# Altium project EDA-02189-V4-0_project.PrjPcb
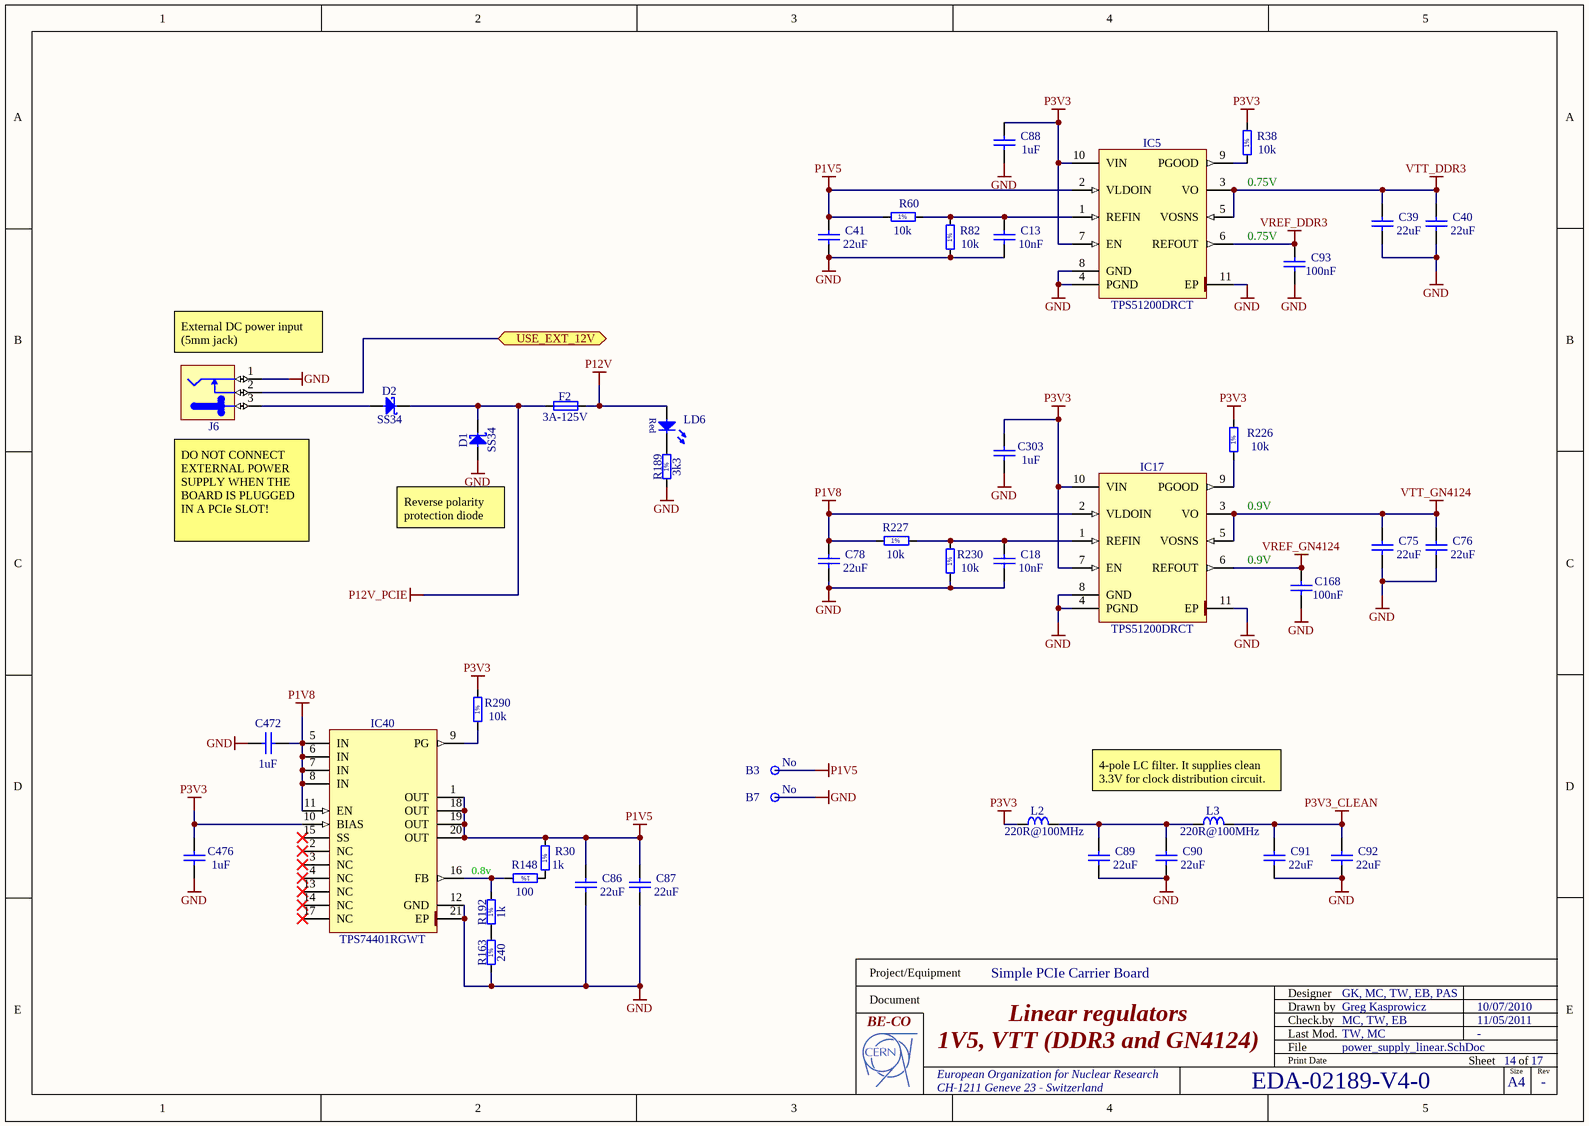
[diagram p0: power_supply_linear.SchDoc]
2 sheets, 119 parts. Net scope: flat (ports and power ports of the same name join across sheets).
Board file: EDA-02189-V4-0_pcb.PcbDoc
Sheets:
  power_supply_linear.SchDoc
  power_supply_switching.SchDoc

## Sheet power_supply_linear.SchDoc: Linear regulators
size 297 x 209 mm; CheckedBy: MC, TW, EB; CompanyName: CERN; DrawnBy: Greg Kasprowicz; Organization: CERN; Address1: European Organization for Nuclear Research; Address2: CH-1211 Geneve 23 - Switzerland; DocumentNumber: 14; Revision: -; SheetNumber: 14; SheetTotal: 17; EDA_Number: EDA-02189-V4-0; Projet: Simple PCIe Carrier Board; ModifiedBy: TW, MC; CreateDate: 10/07/2010; CheckedDate: 11/05/2011; Title2: 1V5, VTT (DDR3 and GN4124); DivGrp: BE-CO; Designer: GK, MC, TW, EB, PAS; ModifiedDate: -

### Parts
B3  Mounted: No  [VERO_20-2136]  (hidden comment: Test Point)
B7  Mounted: No  [VERO_20-2136]  (hidden comment: Test Point)
C13  10nF  [CAPC1608X87N]
C18  10nF  [CAPC1608X87N]
C39  22uF  [CAPC3216X180N]
C40  22uF  [CAPC3216X180N]
C41  22uF  [CAPC3216X180N]
C75  22uF  [CAPC3216X180N]
C76  22uF  [CAPC3216X180N]
C78  22uF  [CAPC3216X180N]
C86  22uF  [CAPC3216X180N]
C87  22uF  [CAPC3216X180N]
C88  1uF  [CAPC1608X87N]
C89  22uF  [CAPC3216X180N]
C90  22uF  [CAPC3216X180N]
C91  22uF  [CAPC3216X180N]
C92  22uF  [CAPC3216X180N]
C93  100nF  [CAPC1005X55N]
C168  100nF  [CAPC1608X87N]
C303  1uF  [CAPC1608X87N]
C472  1uF  [CAPC1608X87N]
C476  1uF  [CAPC1608X87N]
D1  SS34  [DIOM7659X265N]
D2  SS34  [DIOM7659X265N]
F2  3A-125V  [FUSE_LITTELFUSE_0154]
IC5  TPS51200DRCT  [SON50P300X300X100-11N-R175X250]
IC17  TPS51200DRCT  [SON50P300X300X100-11N-R175X250]
IC40  TPS74401RGWT  [QFN65P500X500X100-21N-S325]
J6  Jack  [LUMBERG_161314]  (value not drawn)
L2  220R@100MHz  [INDC2012X105N]
L3  220R@100MHz  [INDC2012X105N]
LD6  Red  [LEDC1608X80N_RED]  (value not drawn)
R30  1k  [RESC1608X55N]
R38  10k  [RESC1608X55N]
R60  10k  [RESC1608X55N]
R82  10k  [RESC1608X55N]
R148  100  [RESC1608X55N]
R163  240  [RESC1608X55N]
R189  3k3  [RESC1608X55N]
R192  1k  [RESC1608X55N]
R226  10k  [RESC1608X55N]
R227  10k  [RESC1608X55N]
R230  10k  [RESC1608X55N]
R290  10k  [RESC1608X55N]

### Ports
USE_EXT_12V (bidir)

### Nets
GND: B7.1 C13.1 C18.1 C39.1 C40.1 C41.1 C75.1 C76.1 C78.1 C86.1 C87.1 C88.1 C89.1 C90.1 C91.1 C92.1 C93.1 C168.1 C303.1 C472.1 C476.1 D1.2(A) IC5.4(PGND) IC5.8(GND) IC5.11(EP) IC17.4(PGND) IC17.8(GND) IC17.11(EP) IC40.12(GND) IC40.21(EP) J6.1 R82.1 R163.1 R189.1 R230.1
P1V5: B3.1 C41.2 C86.2 C87.2 IC5.2(VLDOIN) IC40.1(OUT) IC40.18(OUT) IC40.19(OUT) IC40.20(OUT) R30.2 R60.1
P1V8: C78.2 C472.2 IC17.2(VLDOIN) IC40.5(IN) IC40.6(IN) IC40.7(IN) IC40.8(IN) IC40.11(EN) R227.1
P3V3: C88.2 C303.2 C476.2 IC5.7(EN) IC5.10(VIN) IC17.7(EN) IC17.10(VIN) IC40.10(BIAS) L2.1 R38.2 R226.2 R290.2
P3V3_CLEAN: C91.2 C92.2 L3.2
P12V: F2.2 LD6.2(A)
P12V_PCIE: D1.1(C) D2.1(C) F2.1
VREF_DDR3: C93.2 IC5.6(REFOUT)
VREF_GN4124: C168.2 IC17.6(REFOUT)
VTT_DDR3: C39.2 C40.2 IC5.3(VO) IC5.5(VOSNS)
VTT_GN4124: C75.2 C76.2 IC17.3(VO) IC17.5(VOSNS)
NetC13_2: C13.2 IC5.1(REFIN) R60.2 R82.2
NetC18_2: C18.2 IC17.1(REFIN) R227.2 R230.2
NetC89_2: C89.2 C90.2 L2.2 L3.1
NetD2_2: D2.2(A) J6.3
NetIC5_9: IC5.9(PGOOD) R38.1
NetIC17_9: IC17.9(PGOOD) R226.1
NetIC40_9: IC40.9(PG) R290.1
NetIC40_16: IC40.16(FB) R148.2 R192.2
NetJ6_2: J6.2 ; port USE_EXT_12V
NetLD6_1: LD6.1(C) R189.2
NetR30_1: R30.1 R148.1
NetR163_2: R163.2 R192.1

Not connected (* = marked no-connect by the designer): IC40 2(NC)* 3(NC)* 4(NC)* 13(NC)* 14(NC)* 15(SS)* 17(NC)*

### Notes on the sheet
- (near R38) 0.75V
- (near C93) 0.75V
- (near J6) External DC power input (5mm jack)
- (near J6) DO NOT CONNECT EXTERNAL POWER SUPPLY WHEN THE BOARD IS PLUGGED IN A PCIe SLOT!
- (near D1) Reverse polarity protection diode
- 0.9V
- (near L3) 4-pole LC filter. It supplies clean 3.3V for clock distribution circuit.
- 0.8v
- Project/Equipment
- Document
- Designer
- Drawn by
- Check.by
- File
- Last Mod.
- Print Date
- Sheet
- Size
- A4
- of
- Rev
- (in symbol R0603_1K_1%_0.1W_100PPM) 1%
- (in symbol R0603_3K3_1%_0.1W_100PPM) 1%
- (in symbol R0603_10K_1%_0.1W_100PPM) 1%
- (in symbol R0603_100R_1%_0.1W_100PPM) 1%
- (in symbol R0603_240R_1%_0.1W_100PPM) 1%

### Library data of the parts
B3 B7 = VERO_20-2136: Single Terminal Socket; Part Description: Black Bead PCB Terminal Test Pin (1.32 mm hole); Manufacturer: VERO TECHNOLOGIES; Table: Miscellaneous; Part Number: VERO_20-2136; Component Kind: Standard; Component Type: Standard; Pin Count: 1; Family: Test Point; Socket: No; SMD: No; Status: None; Manufacturer Part Number: 20-2136; ComponentHeight: 5.3mm; HelpURL: \\cern.ch\dfs\Applications\Altium\Datasheets\VERO_20-2136.pdf; Author: CERN DEM JLC; CreateDate: 21/07/2008; LatestRevisionDate: 21/07/2008
C13 C18 = CC0603_10NF_50V_10%_X7R: Non-polarised capacitor; Part Description: SMD Multilayer Chip Ceramic Capacitor; Manufacturer: GENERIC; Manufacturer1 Part Number: 223858615636; Voltage: 50V; TC: X7R; Tolerance: ±10%; Table: Capacitors SMD; Part Number: CC0603_10NF_50V_10%_X7R; Component Kind: Standard; Component Type: Standard; Pin Count: 2; Value: 10nF; Status: Preferred; Manufacturer Part Number: CC0603_10NF_50V_10%_X7R; Case: 0603; Mounted: Yes; Socket: No; SMD: Yes; Manufacturer1 Example: PHYCOMP; Manufacturer1 ComponentHeight: 0.87mm; HelpURL: \\cern.ch\dfs\Applications\Altium\Datasheets\CC0603_X7R_PHYCOMP.pdf; Author: CERN DEM JLC; CreateDate: 03/12/2007; LatestRevisionDate: 03/12/2007
C39-C41 C75 C76 C78 C86 C87 C89-C92 = CC1206_22UF_10V_10%_X7R: Non-polarised capacitor; Part Description: SMD Multilayer Chip Ceramic Capacitor; Manufacturer: GENERIC; Manufacturer1 Part Number: GRM31CR71A226KE15L; Voltage: 10V; TC: X7R; Tolerance: ±10%; Table: Capacitors SMD; Part Number: CC1206_22UF_10V_10%_X7R; Component Kind: Standard; Component Type: Standard; Pin Count: 2; Value: 22uF; Status: Preferred; Manufacturer Part Number: CC1206_22UF_10V_10%_X7R; Case: 1206; Mounted: Yes; Socket: No; SMD: Yes; Manufacturer1 Example: MURATA; Manufacturer1 ComponentHeight: 1.8mm; HelpURL: \\cern.ch\dfs\Applications\Altium\Datasheets\CC1206_X7R_MURATA_GRM-HI-CAP.pdf; Author: CERN DEM JLC; CreateDate: 2010-06-08; LatestRevisionDate: 2010-06-08
C88 C303 C472 C476 = CC0603_1UF_16V_10%_X7R: Non-polarised capacitor; Part Description: SMD Multilayer Chip Ceramic Capacitor; Manufacturer: GENERIC; Manufacturer1 Part Number: 223824613663; Voltage: 16V; TC: X7R; Tolerance: ±10%; Table: Capacitors SMD; Part Number: CC0603_1UF_16V_10%_X7R; Component Kind: Standard; Component Type: Standard; Pin Count: 2; Value: 1uF; Status: Preferred; Manufacturer Part Number: CC0603_1uF_16V_10%_X7R; Case: 0603; Mounted: Yes; Socket: No; SMD: Yes; Manufacturer1 Example: PHYCOMP; Manufacturer1 ComponentHeight: 0.87mm; HelpURL: \\cern.ch\dfs\Applications\Altium\Datasheets\CC0805_X5R_PHYCOMP_HC.pdf; Author: CERN DEM JLC
  C88 C303: CreateDate: 03/12/2007; LatestRevisionDate: 03/12/2007
  C472 C476: CreateDate: 12/3/2007; LatestRevisionDate: 12/3/2007
C93 = CC0402_100NF_16V_10%_X7R: Non-polarised capacitor; Part Description: SMD Multilayer Chip Ceramic Capacitor; Manufacturer: GENERIC; Manufacturer1 Part Number: 223878715649; Manufacturer1 Datasheet: \\cern.ch\dfs\Applications\Altium\Datasheets\CC0402_X7R_PHYCOMP.pdf; Voltage: 16V; TC: X7R; Tolerance: ±10%; Table: Capacitors SMD; Part Number: CC0402_100NF_16V_10%_X7R; Component Kind: Standard; Component Type: Standard; Designator: Capacitor - non polarized; Library Reference: Capacitor - non polarized; Pin Count: 2; Value: 100nF; Status: Not Recommended; Manufacturer Part Number: CC0402_100NF_16V_10%_X7R; Case: 0402; Mounted: Yes; Socket: No; SMD: Yes; Manufacturer1 Example: PHYCOMP; Manufacturer1 ComponentHeight: 0.55mm; HelpURL: \\cern.ch\dfs\Applications\Altium\Datasheets\CC0402_X7R_PHYCOMP.pdf; Author: CERN DEM JLC; CreateDate: 12/3/2007; LatestRevisionDate: 12/3/2007
C168 = CC0603_100NF_50V_10%_X7R: Non-polarised capacitor; Part Description: SMD Multilayer Chip Ceramic Capacitor; Manufacturer: GENERIC; Manufacturer1 Part Number: 223858615649; Voltage: 50V; TC: X7R; Tolerance: ±10%; Table: Capacitors SMD; Part Number: CC0603_100NF_50V_10%_X7R; Component Kind: Standard; Component Type: Standard; Pin Count: 2; Value: 100nF; Status: Preferred; Manufacturer Part Number: CC0603_100NF_50V_10%_X7R; Case: 0603; Mounted: Yes; Socket: No; SMD: Yes; Manufacturer1 Example: PHYCOMP; Manufacturer1 ComponentHeight: 0.87mm; HelpURL: \\cern.ch\dfs\Applications\Altium\Datasheets\CC0603_X7R_PHYCOMP.pdf; Author: CERN DEM JLC; CreateDate: 03/12/2007; LatestRevisionDate: 03/12/2007
D1 D2 = SS34: Schottky Diode; Part Description: Surface Mount Schottky Barrier Rectifier; Manufacturer: FAIRCHILD SEMICONDUCTOR; Voltage: 40V; Power: 3A; Table: Diodes; Part Number: SS34; Component Kind: Standard; Component Type: Standard; Device: SS34; PackageDescription: DO-214-AB/SMC Molded Diode, Body 7.95x5.9mm, IPC Medium Density; Manufacturer Part Number: SS34; Pin Count: 2; Case: DO-214AC; Mounted: Yes; Socket: No; SMD: Yes; ComponentHeight: 2.65mm; HelpURL: \\cern.ch\dfs\Applications\Altium\Datasheets\SS34.pdf; Author: CERN DEM JLC; CreateDate: 8/23/2010; LatestRevisionDate: 8/23/2010
F2 = FUSE_LITTELFUSE_0154003.DR: Fuse; Part Description: SMF OMNI-BLOK® Very Fast-Acting Fuse and Holder; Table: Fuses; Part Number: FUSE_LITTELFUSE_0154003.DR; Component Kind: Standard; Component Type: Standard; Pin Count: 2; PackageDescription: SMF Fuse and Holder, 2-Leads, Body 9.73x5.03mm; Family: Fuse & Holder; Mounted: Yes; Socket: No; SMD: Yes; Value: 3A-125V; Manufacturer: LITTELFUSE; Manufacturer Part Number: 0154003.DR; ComponentHeight: 3.81mm; HelpURL: \\cern.ch\dfs\Applications\Altium\Datasheets\FUSE_LITTELFUSE_0154.pdf; Author: CERN DEM JMW; CreateDate: 1/8/2009; LatestRevisionDate: 1/8/2009
IC5 IC17 = TPS51200DRCT: Sink/Source DDR Termination Regulator; Part Description: 3.3V Sink/Source DDR Termination Regulator; Manufacturer: TEXAS INSTRUMENTS; Table: Regulators; Part Number: TPS51200DRCT; Component Kind: Standard; Component Type: Standard; Device: TPS51200DRCT; PackageDescription: SON, 0.50mm Pitch, 10-pin, 3.00mm W  X 3.00mm L X 1.00mm Height, (w/thermal tab 1.75 X 2.50 mm), IPC Medium Density; Manufacturer Part Number: TPS51200DRCT; Pin Count: 10; Case: SON10; Mounted: Yes; Socket: No; SMD: Yes; ComponentHeight: 1mm; HelpURL: \\cern.ch\dfs\Applications\Altium\Datasheets\TPS51200DRCT.pdf; Author: CERN DEM JLC; CreateDate: 2/3/2010; LatestRevisionDate: 2/3/2010
IC40 = TPS74401RGWT: Single Output LDO, 3.0A, Adj.(0.8 to 3.3V), Fast Transient Response, Programmable SoftStart; Manufacturer: TEXAS INSTRUMENTS; Table: Regulators; Part Number: TPS74401RGWT; Component Kind: Standard; Component Type: Standard; Device: TPS74401RGWT; PackageDescription: QFN, 0.65mm pitch,square; 20 pin, 5mm X 5mm X 1mm H body (w/thermal tab 3.25 X 3.25mm),  IPC Medium Density; Part Description: Single Output LDO, 3.0A, Adj.(0.8 to 3.3V), Fast Transient Response, Programmable SoftStart; Manufacturer Part Number: TPS74401RGWT; Pin Count: 21; Case: QFN20; Mounted: Yes; Socket: No; SMD: Yes; ComponentHeight: 1mm; HelpURL: \\cern.ch\dfs\Applications\Altium\Datasheets\TPS74401RGWT.pdf; Author: CERN DEM JLC; CreateDate: 2/2/2010; LatestRevisionDate: 2/2/2010
J6 = LUMBERG_161314: 24V /3. 5A, 2.1mm Diameter Pin, SMD DC Power Supply Connector With  Break Contact; Manufacturer Part Number: 161314; Table: Miscellaneous; Part Number: LUMBERG_161314; Component Kind: Standard; Component Type: Standard; Pin Count: 3; Family: Jack; Mounted: Yes; Socket: No; SMD: Yes; Status: None; Part Description: 24V/3. 5A, 2.1mm Diameter Pin, SMD DC Power Supply Connector With  Break Contact; Manufacturer: LUMBERG; ComponentHeight: 11mm; HelpURL: \\cern.ch\dfs\Applications\Altium\Datasheets\LUMBERG_161314.pdf; Author: CERN DEM JLC; CreateDate: 2/15/2011; LatestRevisionDate: 3/2/2011
L2 L3 = IND0805_MURATA_BLM21PG221SN1D: Inductor; Part Description: SMD EMIFIL Suppression Chip Bead Ferrite; Manufacturer: MURATA; Power: 2A; Resistance: 0.05R; Tolerance: ±25%; Table: Inductors SMD; Part Number: IND0805_MURATA_BLM21PG221SN1D; Component Kind: Standard; Component Type: Standard; Pin Count: 2; Value: 220R@100MHz; Status: None; Manufacturer Part Number: BLM21PG221SN1D; Case: 0805; Mounted: Yes; Socket: No; SMD: Yes; ComponentHeight: 1.05mm; HelpURL: \\cern.ch\dfs\Applications\Altium\Datasheets\IND0402_MURATA_BLM21P.pdf; Author: CERN DEM JLC; CreateDate: 25/01/2010; LatestRevisionDate: 25/01/2010
LD6 = LED_ROHM_SML-311UTT86K: LED Red 1C 2A; Part Description: Low current chip LED SML-311 Serie; Manufacturer: ROHM; Table: LEDs & Displays; Part Number: LED_ROHM_SML-311UTT86K; Component Kind: Standard; Component Type: Standard; Color: Red; PackageDescription: Chip Red LED, 2-Leads, Body 1.6x0.8mm, IPC Medium Density; Manufacturer Part Number: SML-311UTT86K; Pin Count: 2; Mounted: Yes; Socket: No; SMD: Yes; ComponentHeight: 0.8mm; HelpURL: \\cern.ch\dfs\Applications\Altium\Datasheets\LED_ROHM_SML-311UTT86K.pdf; Author: CERN DEM JLC; CreateDate: 3/16/2010; LatestRevisionDate: 3/17/2010
R30 R192 = R0603_1K_1%_0.1W_100PPM: Resistor - 1%; Part Description: General Purpose Thick Film Chip Resistor; Manufacturer: GENERIC; Manufacturer1 Part Number: NRC06F1001TRF; Power: 0.1W; TC: ±100ppm/°C; Table: Resistors SMD; Part Number: R0603_1K_1%_0.1W_100PPM; Component Kind: Standard; Component Type: Standard; Pin Count: 2; Value: 1k; Status: Preferred; Tolerance: ±1%; Manufacturer Part Number: R0603_1K_1%_0.1W_100PPM; Case: 0603; Mounted: Yes; Socket: No; SMD: Yes; Manufacturer1 Example: NIC COMPONENT; Manufacturer1 ComponentHeight: 0.55mm; HelpURL: \\cern.ch\dfs\Applications\Altium\Datasheets\R0603_NIC_NRC.pdf; Author: CERN DEM JLC; CreateDate: 12/3/2007; LatestRevisionDate: 3/13/2008
R38 R60 R82 R226 R227 R230 R290 = R0603_10K_1%_0.1W_100PPM: Resistor - 1%; Part Description: General Purpose Thick Film Chip Resistor; Manufacturer: GENERIC; Manufacturer1 Part Number: NRC06F1002TRF; Power: 0.1W; TC: ±100ppm/°C; Table: Resistors SMD; Part Number: R0603_10K_1%_0.1W_100PPM; Component Kind: Standard; Component Type: Standard; Pin Count: 2; Value: 10k; Status: Preferred; Tolerance: ±1%; Manufacturer Part Number: R0603_10K_1%_0.1W_100PPM; Case: 0603; Mounted: Yes; Socket: No; SMD: Yes; Manufacturer1 Example: NIC COMPONENT; Manufacturer1 ComponentHeight: 0.55mm; HelpURL: \\cern.ch\dfs\Applications\Altium\Datasheets\R0603_NIC_NRC.pdf; Author: CERN DEM JLC
  R38 R60 R82 R227 R230 R290: CreateDate: 12/3/2007; LatestRevisionDate: 3/13/2008
  R226: CreateDate: 03/12/2007; LatestRevisionDate: 13/03/2008
R148 = R0603_100R_1%_0.1W_100PPM: Resistor - 1%; Part Description: General Purpose Thick Film Chip Resistor; Manufacturer: GENERIC; Manufacturer1 Part Number: NRC06F4700TRF; Power: 0.1W; TC: ±100ppm/°C; Table: Resistors SMD; Part Number: R0603_100R_1%_0.1W_100PPM; Component Kind: Standard; Component Type: Standard; Pin Count: 2; Value: 100; Status: Preferred; Tolerance: ±1%; Manufacturer Part Number: R0603_100R_1%_0.1W_100PPM; Case: 0603; Mounted: Yes; Socket: No; SMD: Yes; Manufacturer1 Example: NIC COMPONENT; Manufacturer1 ComponentHeight: 0.55mm; HelpURL: \\cern.ch\dfs\Applications\Altium\Datasheets\R0603_NIC_NRC.pdf; Author: CERN DEM JLC; CreateDate: 2007-12-03; LatestRevisionDate: 2008-03-13
R163 = R0603_240R_1%_0.1W_100PPM: Resistor - 1%; Part Description: General Purpose Thick Film Chip Resistor; Manufacturer: GENERIC; Manufacturer1 Part Number: NRC06F2400TRF; Power: 0.1W; TC: ±100ppm/°C; Table: Resistors SMD; Part Number: R0603_240R_1%_0.1W_100PPM; Component Kind: Standard; Component Type: Standard; Pin Count: 2; Value: 240; Status: Preferred; Tolerance: ±1%; Manufacturer Part Number: R0603_240R_1%_0.1W_100PPM; Case: 0603; Mounted: Yes; Socket: No; SMD: Yes; Manufacturer1 Example: NIC COMPONENT; Manufacturer1 ComponentHeight: 0.55mm; HelpURL: \\cern.ch\dfs\Applications\Altium\Datasheets\R0603_NIC_NRC.pdf; Author: CERN DEM JLC; CreateDate: 12/3/2007; LatestRevisionDate: 3/13/2008
R189 = R0603_3K3_1%_0.1W_100PPM: Resistor - 1%; Part Description: General Purpose Thick Film Chip Resistor; Manufacturer: GENERIC; Manufacturer1 Part Number: NRC06F3301TRF; Power: 0.1W; TC: ±100ppm/°C; Table: Resistors SMD; Part Number: R0603_3K3_1%_0.1W_100PPM; Component Kind: Standard; Component Type: Standard; Pin Count: 2; Value: 3k3; Status: Preferred; Tolerance: ±1%; Manufacturer Part Number: R0603_3K3_1%_0.1W_100PPM; Case: 0603; Mounted: Yes; Socket: No; SMD: Yes; Manufacturer1 Example: NIC COMPONENT; Manufacturer1 ComponentHeight: 0.55mm; HelpURL: \\cern.ch\dfs\Applications\Altium\Datasheets\R0603_NIC_NRC.pdf; Author: CERN DEM JLC; CreateDate: 12/3/2007; LatestRevisionDate: 3/13/2008

## Sheet power_supply_switching.SchDoc: Switching regulators
size 297 x 209 mm; CheckedBy: MC, TW, EB; CompanyName: CERN; DrawnBy: Greg Kasprowicz; Organization: CERN; Address1: European Organization for Nuclear Research; Address2: CH-1211 Geneve 23 - Switzerland; DocumentNumber: 15; Revision: -; SheetNumber: 15; SheetTotal: 17; EDA_Number: EDA-02189-V4-0; Projet: Simple PCIe Carrier Board; ModifiedBy: TW, MC; CreateDate: 10/07/2010; CheckedDate: 11/05/2011; Title2: 3.3V, 2.5V, 1.8V and 1.2V; DivGrp: BE-CO; Designer: GK, MC, TW, EB, PAS; ModifiedDate: -
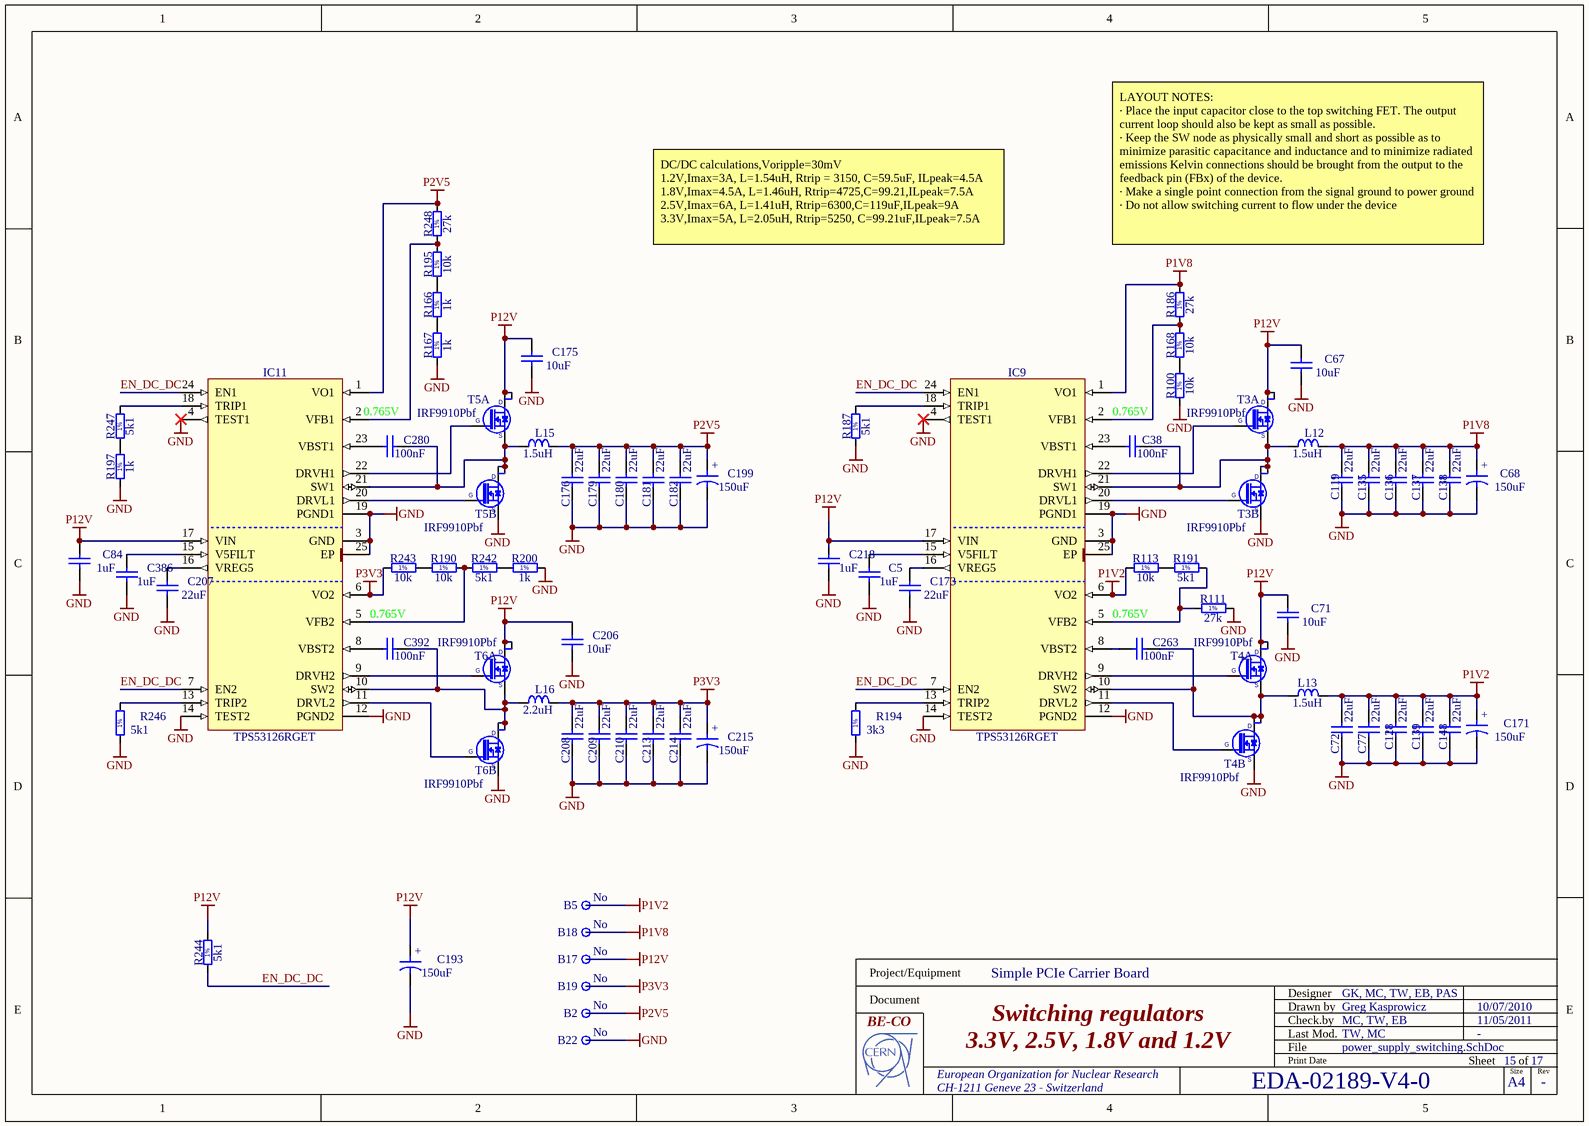
[diagram p1: power_supply_switching.SchDoc]

### Parts
B2  Mounted: No  [VERO_20-2136]  (hidden comment: Test Point)
B5  Mounted: No  [VERO_20-2136]  (hidden comment: Test Point)
B17  Mounted: No  [VERO_20-2136]  (hidden comment: Test Point)
B18  Mounted: No  [VERO_20-2136]  (hidden comment: Test Point)
B19  Mounted: No  [VERO_20-2136]  (hidden comment: Test Point)
B22  Mounted: No  [VERO_20-2136]  (hidden comment: Test Point)
C5  1uF  [CAPC1608X87N]
C38  100nF  [CAPC1608X87N]
C67  10uF  [CAPC3225X270N]
C68  150uF  [CAPPR350-850X700]
C71  10uF  [CAPC3225X270N]
C72  22uF  [CAPC3216X180N]
C77  22uF  [CAPC3216X180N]
C84  1uF  [CAPC1608X87N]
C119  22uF  [CAPC3216X180N]
C128  22uF  [CAPC3216X180N]
C135  22uF  [CAPC3216X180N]
C136  22uF  [CAPC3216X180N]
C137  22uF  [CAPC3216X180N]
C138  22uF  [CAPC3216X180N]
C139  22uF  [CAPC3216X180N]
C148  22uF  [CAPC3216X180N]
C171  150uF  [CAPPR350-850X700]
C173  22uF  [CAPC3216X180N]
C175  10uF  [CAPC3225X270N]
C176  22uF  [CAPC3216X180N]
C179  22uF  [CAPC3216X180N]
C180  22uF  [CAPC3216X180N]
C181  22uF  [CAPC3216X180N]
C182  22uF  [CAPC3216X180N]
C193  150uF  [CAPPR500-1050X800]
C199  150uF  [CAPPR350-850X700]
C206  10uF  [CAPC3225X270N]
C207  22uF  [CAPC3216X180N]
C208  22uF  [CAPC3216X180N]
C209  22uF  [CAPC3216X180N]
C210  22uF  [CAPC3216X180N]
C213  22uF  [CAPC3216X180N]
C214  22uF  [CAPC3216X180N]
C215  150uF  [CAPPR350-850X700]
C218  1uF  [CAPC1608X87N]
C263  100nF  [CAPC1608X87N]
C280  100nF  [CAPC1608X87N]
C386  1uF  [CAPC1608X87N]
C392  100nF  [CAPC1608X87N]
IC9  TPS53126RGET  [QFN50P400X400X100-25N-S255]
IC11  TPS53126RGET  [QFN50P400X400X100-25N-S255]
L12  1.5uH  [IND_BOURNS_SRR1260]
L13  1.5uH  [IND_BOURNS_SRR1260]
L15  1.5uH  [IND_BOURNS_SRR1260]
L16  2.2uH  [IND_BOURNS_SRR1260]
R100  10k  [RESC1608X55N]
R111  27k  [RESC1608X55N]
R113  10k  [RESC1608X55N]
R166  1k  [RESC1608X55N]
R167  1k  [RESC1608X55N]
R168  10k  [RESC1608X55N]
R186  27k  [RESC1608X55N]
R187  5k1  [RESC1608X55N]
R190  10k  [RESC1608X55N]
R191  5k1  [RESC1608X55N]
R194  3k3  [RESC1608X55N]
R195  10k  [RESC1608X55N]
R197  1k  [RESC1608X55N]
R200  1k  [RESC1608X55N]
R242  5k1  [RESC1608X55N]
R243  10k  [RESC1608X55N]
R244  5k1  [RESC1608X55N]
R246  5k1  [RESC1608X55N]
R247  5k1  [RESC1608X55N]
R248  27k  [RESC1608X55N]
T3  IRF9910Pbf  [SOIC127P600X175-8N]  (parts A,B of 2)
T4  IRF9910Pbf  [SOIC127P600X175-8N]  (parts A,B of 2)
T5  IRF9910Pbf  [SOIC127P600X175-8N]  (parts A,B of 2)
T6  IRF9910Pbf  [SOIC127P600X175-8N]  (parts A,B of 2)

### Nets
GND: B22.1 C5.1 C67.2 C68.2 C71.2 C72.1 C77.1 C84.2 C119.1 C128.1 C135.1 C136.1 C137.1 C138.1 C139.1 C148.1 C171.2 C173.1 C175.2 C176.1 C179.1 C180.1 C181.1 C182.1 C193.2 C199.2 C206.2 C207.1 C208.1 C209.1 C210.1 C213.1 C214.1 C215.2 C218.1 C386.1 IC9.3(GND) IC9.4(TEST1) IC9.12(PGND2) IC9.14(TEST2) IC9.19(PGND1) IC9.25(EP) IC11.3(GND) IC11.4(TEST1) IC11.12(PGND2) IC11.14(TEST2) IC11.19(PGND1) IC11.25(EP) R100.1 R111.2 R167.1 R187.1 R194.1 R197.1 R200.2 R246.1 T3.1(S) T4.1(S) T5.1(S) T6.1(S)
P1V2: B5.1 C72.2 C77.2 C128.2 C139.2 C148.2 C171.1 IC9.6(VO2) L13.2 R113.1
P1V8: B18.1 C68.1 C119.2 C135.2 C136.2 C137.2 C138.2 IC9.1(VO1) L12.2 R186.2
P2V5: B2.1 C176.2 C179.2 C180.2 C181.2 C182.2 C199.1 IC11.1(VO1) L15.2 R248.2
P3V3: B19.1 C208.2 C209.2 C210.2 C213.2 C214.2 C215.1 IC11.6(VO2) L16.2 R243.1
P12V: B17.1 C67.1 C71.1 C84.1 C175.1 C193.1 C206.1 C218.2 IC9.17(VIN) IC11.17(VIN) R244.2 T3.5(D) T3.6(D) T4.5(D) T4.6(D) T5.5(D) T5.6(D) T6.5(D) T6.6(D)
EN_DC_DC: IC9.7(EN2) IC9.24(EN1) IC11.7(EN2) IC11.24(EN1) R244.1
NetC5_2: C5.2 IC9.15(V5FILT)
NetC38_1: C38.1 IC9.21(SW1) L12.1 T3.3(S) T3.7(D) T3.8(D)
NetC38_2: C38.2 IC9.23(VBST1)
NetC173_2: C173.2 IC9.16(VREG5)
NetC207_2: C207.2 IC11.16(VREG5)
NetC263_1: C263.1 IC9.10(SW2) L13.1 T4.3(S) T4.7(D) T4.8(D)
NetC263_2: C263.2 IC9.8(VBST2)
NetC280_1: C280.1 IC11.21(SW1) L15.1 T5.3(S) T5.7(D) T5.8(D)
NetC280_2: C280.2 IC11.23(VBST1)
NetC386_2: C386.2 IC11.15(V5FILT)
NetC392_1: C392.1 IC11.10(SW2) L16.1 T6.3(S) T6.7(D) T6.8(D)
NetC392_2: C392.2 IC11.8(VBST2)
NetIC9_2: IC9.2(VFB1) R168.2 R186.1
NetIC9_5: IC9.5(VFB2) R111.1 R191.2
NetIC9_9: IC9.9(DRVH2) T4.4(G)
NetIC9_11: IC9.11(DRVL2) T4.2(G)
NetIC9_13: IC9.13(TRIP2) R194.2
NetIC9_18: IC9.18(TRIP1) R187.2
NetIC9_20: IC9.20(DRVL1) T3.2(G)
NetIC9_22: IC9.22(DRVH1) T3.4(G)
NetIC11_2: IC11.2(VFB1) R195.2 R248.1
NetIC11_5: IC11.5(VFB2) R190.2 R242.1
NetIC11_9: IC11.9(DRVH2) T6.4(G)
NetIC11_11: IC11.11(DRVL2) T6.2(G)
NetIC11_13: IC11.13(TRIP2) R246.2
NetIC11_18: IC11.18(TRIP1) R247.2
NetIC11_20: IC11.20(DRVL1) T5.2(G)
NetIC11_22: IC11.22(DRVH1) T5.4(G)
NetR100_2: R100.2 R168.1
NetR113_2: R113.2 R191.1
NetR166_1: R166.1 R167.2
NetR166_2: R166.2 R195.1
NetR190_1: R190.1 R243.2
NetR197_2: R197.2 R247.1
NetR200_1: R200.1 R242.2

### Notes on the sheet
- DC/DC calculations,Voripple=30mV
  1.2V,Imax=3A, L=1.54uH, Rtrip = 3150, C=59.5uF, ILpeak=4.5A
  1.8V,Imax=4.5A, L=1.46uH, Rtrip=4725,C=99.21,ILpeak=7.5A
  2.5V,Imax=6A, L=1.41uH, Rtrip=6300,C=119uF,ILpeak=9A
  3.3V,Imax=5A, L=2.05uH, Rtrip=5250, C=99.21uF,ILpeak=7.5A
- (near R186) LAYOUT NOTES:
  · Place the input capacitor close to the top switching FET. The output current loop should also be kept as small as possible.
  · Keep the SW node as physically small and short as possible as to minimize parasitic capacitance and inductance and to minimize radiated emissions Kelvin connections should be brought from the output to the feedback pin (FBx) of the device.
  · Make a single point connection from the signal ground to power ground
  · Do not allow switching current to flow under the device
- 0.765V
- Project/Equipment
- Document
- Designer
- Drawn by
- Check.by
- File
- Last Mod.
- Print Date
- Sheet
- Size
- A4
- of
- Rev
- (in symbol CAER_150UF_6.3V_20%_SANYO_6SEQP150M) +
- (in symbol CAER_150UF_16V_20%_SANYO_16SEQP150M) +
- (in symbol R0603_1K_1%_0.1W_100PPM) 1%
- (in symbol R0603_3K3_1%_0.1W_100PPM) 1%
- (in symbol R0603_5K1_1%_0.1W_100PPM) 1%
- (in symbol R0603_10K_1%_0.1W_100PPM) 1%
- (in symbol R0603_27K_1%_0.1W_100PPM) 1%

### Library data of the parts
B2 B5 B17-B19 B22 = VERO_20-2136: as B3 on sheet power_supply_linear; Part Number: VERO_20-2136; Component Kind: Standard; Component Type: Standard; Pin Count: 1; Family: Test Point; Socket: No; SMD: No; Status: None; Manufacturer Part Number: 20-2136; ComponentHeight: 5.3mm; HelpURL: \\cern.ch\dfs\Applications\Altium\Datasheets\VERO_20-2136.pdf; Author: CERN DEM JLC; CreateDate: 21/07/2008; LatestRevisionDate: 21/07/2008
C5 C84 C218 C386 = CC0603_1UF_16V_10%_X7R: as C88 on sheet power_supply_linear; Part Number: CC0603_1UF_16V_10%_X7R; Component Kind: Standard; Component Type: Standard; Pin Count: 2; Value: 1uF; Status: Preferred; Manufacturer Part Number: CC0603_1uF_16V_10%_X7R; Case: 0603; Mounted: Yes; Socket: No; SMD: Yes; Manufacturer1 Example: PHYCOMP; Manufacturer1 ComponentHeight: 0.87mm; HelpURL: \\cern.ch\dfs\Applications\Altium\Datasheets\CC0805_X5R_PHYCOMP_HC.pdf; Author: CERN DEM JLC
  C5 C386: CreateDate: 03/12/2007; LatestRevisionDate: 03/12/2007
  C84 C218: CreateDate: 12/3/2007; LatestRevisionDate: 12/3/2007
C38 C263 C280 C392 = CC0603_100NF_50V_10%_X7R: as C168 on sheet power_supply_linear; Part Number: CC0603_100NF_50V_10%_X7R; Component Kind: Standard; Component Type: Standard; Pin Count: 2; Value: 100nF; Status: Preferred; Manufacturer Part Number: CC0603_100NF_50V_10%_X7R; Case: 0603; Mounted: Yes; Socket: No; SMD: Yes; Manufacturer1 Example: PHYCOMP; Manufacturer1 ComponentHeight: 0.87mm; HelpURL: \\cern.ch\dfs\Applications\Altium\Datasheets\CC0603_X7R_PHYCOMP.pdf; Author: CERN DEM JLC; CreateDate: 2007-12-03; LatestRevisionDate: 2007-12-03
C67 C71 C175 C206 = CC1210_10UF_25V_10%_X7R: Non-polarised capacitor; Part Description: SMD Multilayer Chip Ceramic Capacitor; Manufacturer: GENERIC; Manufacturer1 Part Number: C1210C106K3RAC; Voltage: 25V; TC: X7R; Tolerance: ±10%; Table: Capacitors SMD; Part Number: CC1210_10UF_25V_10%_X7R; Component Kind: Standard; Component Type: Standard; Pin Count: 2; Value: 10uF; Status: None; Manufacturer Part Number: CC1210_10UF_25V_10%_X7R; Case: 1210; Mounted: Yes; Socket: No; SMD: Yes; Manufacturer1 Example: KEMET; Manufacturer1 ComponentHeight: 2.7mm; HelpURL: \\cern.ch\dfs\Applications\Altium\Datasheets\CC1210_X7R_KEMET.pdf; Author: CERN DEM JLC; CreateDate: 5/5/2009; LatestRevisionDate: 4/1/2010
C68 C171 C199 C215 = CAER_150UF_6.3V_20%_SANYO_6SEQP150M: Polarised capacitor; Part Description: Aluminium Solid Capacitor With Conductive Polymer (SEQP Serie); Manufacturer: SANYO OS-CON; Voltage: 6.3V; Tolerance: ±20%; Table: Capacitors THD; Part Number: CAER_150UF_6.3V_20%_SANYO_6SEQP150M; Component Kind: Standard; Component Type: Standard; Pin Count: 2; Value: 150uF; Status: Not Recommended; Manufacturer Part Number: 6SEQP150M; Case: LS3.5 D8 x H7; Mounted: Yes; Socket: No; SMD: No; ComponentHeight: 7mm; HelpURL: \\cern.ch\dfs\Applications\Altium\Datasheets\CAER_SANYO_SEQP.pdf; Author: CERN DEM JLC; CreateDate: 3/7/2011; LatestRevisionDate: 3/7/2011
C72 C77 C119 C128 C135-C139 C148 C173 C176 C179-C182 C207-C210 C213 C214 = CC1206_22UF_10V_10%_X7R: as C39 on sheet power_supply_linear; Part Number: CC1206_22UF_10V_10%_X7R; Component Kind: Standard; Component Type: Standard; Pin Count: 2; Value: 22uF; Status: Preferred; Manufacturer Part Number: CC1206_22UF_10V_10%_X7R; Case: 1206; Mounted: Yes; Socket: No; SMD: Yes; Manufacturer1 Example: MURATA; Manufacturer1 ComponentHeight: 1.8mm; HelpURL: \\cern.ch\dfs\Applications\Altium\Datasheets\CC1206_X7R_MURATA_GRM-HI-CAP.pdf; Author: CERN DEM JLC; CreateDate: 2010-06-08; LatestRevisionDate: 2010-06-08
C193 = CAER_150UF_16V_20%_SANYO_16SEQP150M: Polarised capacitor; Part Description: Aluminium Solid Capacitor With Conductive Polymer (SEQP Serie); Manufacturer: SANYO OS-CON; Voltage: 16V; Tolerance: ±20%; Table: Capacitors THD; Part Number: CAER_150UF_16V_20%_SANYO_16SEQP150M; Component Kind: Standard; Component Type: Standard; Pin Count: 2; Value: 150uF; Status: Not Recommended; Manufacturer Part Number: 16SEQP150M; Case: LS5 D10 x H8; Mounted: Yes; Socket: No; SMD: No; ComponentHeight: 8mm; HelpURL: \\cern.ch\dfs\Applications\Altium\Datasheets\CAER_SANYO_SEQP.pdf; Author: CERN DEM JLC; CreateDate: 3/7/2011; LatestRevisionDate: 3/7/2011
IC9 IC11 = TPS53126RGET: Dual Synchronous Step-Down Controller For Low Voltage Power Rails; Manufacturer: TEXAS INSTRUMENTS; Table: Analog & Interface; Part Number: TPS53126RGET; Component Kind: Standard; Component Type: Standard; Device: TPS53126RGET; PackageDescription: QFN,0.50mm pitch,square;6 pin X 6 pin,4.15mm X 4.15mm X 1.00mm H body (w/thermal tab 2.55 X 2.55mm),  IPC Medium Density; Part Description: Dual Synchronous Step-Down Controller For Low Voltage Power Rails; Manufacturer Part Number: TPS53126RGET; Pin Count: 25; Case: QFN24; Mounted: Yes; Socket: No; SMD: Yes; ComponentHeight: 1.0mm; Author: CERN DEM JLC; HelpURL: \\cern.ch\dfs\Applications\Altium\Datasheets\TPS53126RGET.pdf; CreateDate: 2010-08-26; LatestRevisionDate: 2010-08-26
L12 L13 L15 = IND_1.5UH_30%_BOURNS_SRR1260: Inductor; Part Description: Shielded SMD Power Inductors; Manufacturer: BOURNS; Manufacturer Part Number: SRR1260-1R5Y; Power: 8.8A; Resistance: 0.0095R; Tolerance: ±30%; Table: Inductors SMD; Part Number: IND_1.5UH_30%_BOURNS_SRR1260; Component Kind: Standard; Component Type: Standard; Pin Count: 2; Value: 1.5uH; Status: None; Mounted: Yes; Socket: No; SMD: Yes; ComponentHeight: 6.5mm; HelpURL: \\cern.ch\dfs\Applications\Altium\Datasheets\IND_BOURNS_SRR1260.pdf; Author: CERN DEM JLC; CreateDate: 2010-08-30; LatestRevisionDate: 2010-08-30
L16 = IND_2.2UH_30%_BOURNS_SRR1260: Inductor; Part Description: Shielded SMD Power Inductors; Manufacturer: BOURNS; Manufacturer Part Number: SRR1260-2R2Y; Power: 8.2A; Resistance: 0.0105R; Tolerance: ±30%; Table: Inductors SMD; Part Number: IND_2.2UH_30%_BOURNS_SRR1260; Component Kind: Standard; Component Type: Standard; Pin Count: 2; Value: 2.2uH; Status: None; Mounted: Yes; Socket: No; SMD: Yes; ComponentHeight: 6.5mm; HelpURL: \\cern.ch\dfs\Applications\Altium\Datasheets\IND_BOURNS_SRR1260.pdf; Author: CERN DEM JLC; CreateDate: 2010-08-30; LatestRevisionDate: 2010-08-30
R100 R113 R168 R190 R195 R243 = R0603_10K_1%_0.1W_100PPM: as R38 on sheet power_supply_linear; Part Number: R0603_10K_1%_0.1W_100PPM; Component Kind: Standard; Component Type: Standard; Pin Count: 2; Value: 10k; Status: Preferred; Tolerance: ±1%; Manufacturer Part Number: R0603_10K_1%_0.1W_100PPM; Case: 0603; Mounted: Yes; Socket: No; SMD: Yes; Manufacturer1 Example: NIC COMPONENT; Manufacturer1 ComponentHeight: 0.55mm; HelpURL: \\cern.ch\dfs\Applications\Altium\Datasheets\R0603_NIC_NRC.pdf; Author: CERN DEM JLC; CreateDate: 12/3/2007; LatestRevisionDate: 3/13/2008
R111 R186 R248 = R0603_27K_1%_0.1W_100PPM: Resistor - 1%; Part Description: General Purpose Thick Film Chip Resistor; Manufacturer: GENERIC; Manufacturer1 Part Number: NRC06F2702TRF; Power: 0.1W; TC: ±100ppm/°C; Table: Resistors SMD; Part Number: R0603_27K_1%_0.1W_100PPM; Component Kind: Standard; Component Type: Standard; Pin Count: 2; Value: 27k; Status: Preferred; Tolerance: ±1%; Manufacturer Part Number: R0603_27K_1%_0.1W_100PPM; Case: 0603; Mounted: Yes; Socket: No; SMD: Yes; Manufacturer1 Example: NIC COMPONENT; Manufacturer1 ComponentHeight: 0.55mm; HelpURL: \\cern.ch\dfs\Applications\Altium\Datasheets\R0603_NIC_NRC.pdf; Author: CERN DEM JLC; CreateDate: 12/3/2007; LatestRevisionDate: 3/13/2008
R166 R167 R197 R200 = R0603_1K_1%_0.1W_100PPM: as R30 on sheet power_supply_linear; Part Number: R0603_1K_1%_0.1W_100PPM; Component Kind: Standard; Component Type: Standard; Pin Count: 2; Value: 1k; Status: Preferred; Tolerance: ±1%; Manufacturer Part Number: R0603_1K_1%_0.1W_100PPM; Case: 0603; Mounted: Yes; Socket: No; SMD: Yes; Manufacturer1 Example: NIC COMPONENT; Manufacturer1 ComponentHeight: 0.55mm; HelpURL: \\cern.ch\dfs\Applications\Altium\Datasheets\R0603_NIC_NRC.pdf; Author: CERN DEM JLC; CreateDate: 12/3/2007; LatestRevisionDate: 3/13/2008
R187 R191 R242 R244 R246 R247 = R0603_5K1_1%_0.1W_100PPM: Resistor - 1%; Part Description: General Purpose Thick Film Chip Resistor; Manufacturer: GENERIC; Manufacturer1 Part Number: NRC06F5101TRF; Power: 0.1W; TC: ±100ppm/°C; Table: Resistors SMD; Part Number: R0603_5K1_1%_0.1W_100PPM; Component Kind: Standard; Component Type: Standard; Pin Count: 2; Value: 5k1; Status: Preferred; Tolerance: ±1%; Manufacturer Part Number: R0603_5K1_1%_0.1W_100PPM; Case: 0603; Mounted: Yes; Socket: No; SMD: Yes; Manufacturer1 Example: NIC COMPONENT; Manufacturer1 ComponentHeight: 0.55mm; HelpURL: \\cern.ch\dfs\Applications\Altium\Datasheets\R0603_NIC_NRC.pdf; Author: CERN DEM JLC
  R187 R191 R242 R244 R247: CreateDate: 12/3/2007; LatestRevisionDate: 3/13/2008
  R246: CreateDate: 2007-12-03; LatestRevisionDate: 2008-03-13
R194 = R0603_3K3_1%_0.1W_100PPM: as R189 on sheet power_supply_linear; Part Number: R0603_3K3_1%_0.1W_100PPM; Component Kind: Standard; Component Type: Standard; Pin Count: 2; Value: 3k3; Status: Preferred; Tolerance: ±1%; Manufacturer Part Number: R0603_3K3_1%_0.1W_100PPM; Case: 0603; Mounted: Yes; Socket: No; SMD: Yes; Manufacturer1 Example: NIC COMPONENT; Manufacturer1 ComponentHeight: 0.55mm; HelpURL: \\cern.ch\dfs\Applications\Altium\Datasheets\R0603_NIC_NRC.pdf; Author: CERN DEM JLC; CreateDate: 2007-12-03; LatestRevisionDate: 2008-03-13
T3-T6 = IRF9910Pbf: Dual SO-8 MOSFET For POL Cconverter; Part Description: 20V 10A(Q1) 20V 12A (Q2) Dual SO-8 MOSFET For POL Cconverter; Manufacturer: INTERNATIONAL RECTIFIER; Table: Transistors; Part Number: IRF9910Pbf; Component Kind: Standard; Component Type: Standard; Device: IRF9910Pbf; PackageDescription: SOIC 8, Pitch 1.27mm - Body 4x5mm, IPC Medium Density; Manufacturer Part Number: IRF9910Pbf; Pin Count: 8; Case: DO8; Mounted: Yes; Socket: No; SMD: Yes; ComponentHeight: 1.75mm; HelpURL: \\cern.ch\dfs\Applications\Altium\Datasheets\IRF9910Pbf.pdf; Author: CERN DEM JLC; CreateDate: 2010-08-30; LatestRevisionDate: 2010-08-30

## Nets that join several sheets
GND: power_supply_linear (35 pins), power_supply_switching (60 pins)
P1V8: power_supply_linear (9 pins), power_supply_switching (10 pins)
P3V3: power_supply_linear (12 pins), power_supply_switching (10 pins)
P12V: power_supply_linear (F2.2 LD6.2), power_supply_switching (19 pins)